# EAGLE design Platine (EAGLE 7.3.0)
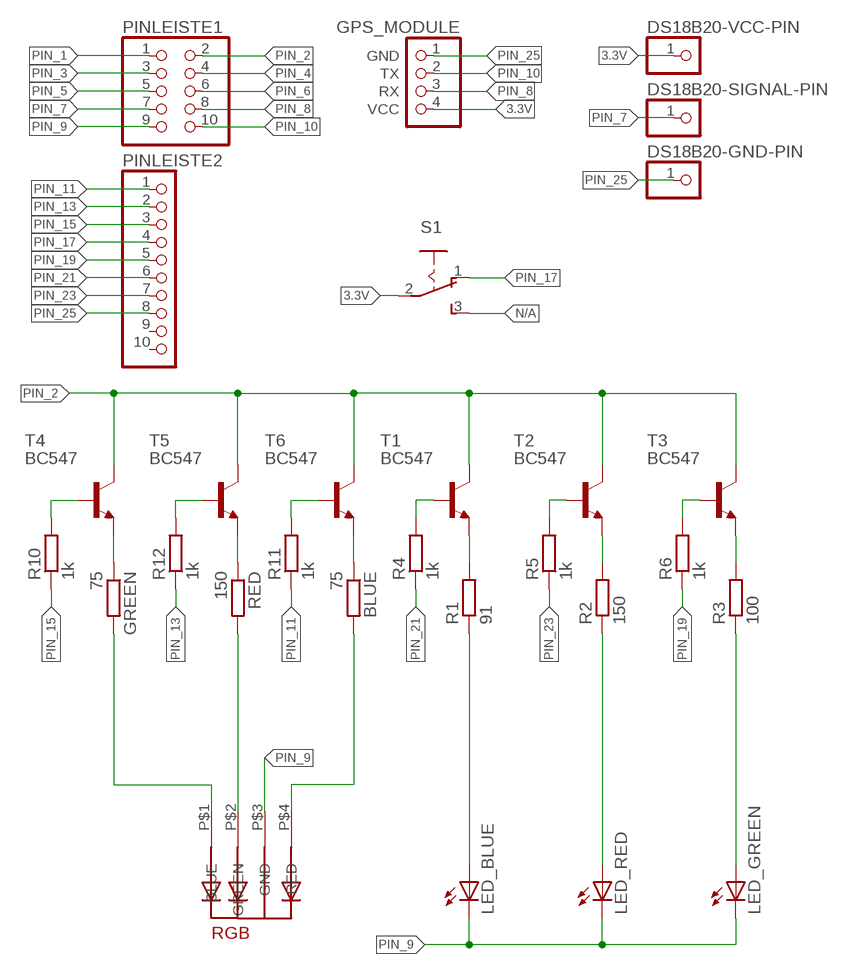
[diagram p0: schematic, sheet 1]

## Parts
BLUE  75  R-EU_0207/10  [0207/10]
DS18B20-GND-PIN  PINHD-1X1  [1X01]
DS18B20-SIGNAL-PIN  PINHD-1X1  [1X01]
DS18B20-VCC-PIN  PINHD-1X1  [1X01]
GPS_MODULE  PINHD-1X4  [1X04]
GREEN  75  R-EU_0207/10  [0207/10]
LED_BLUE  LED5MM  [LED5MM]
LED_GREEN  LED5MM  [LED5MM]
LED_RED  LED5MM  [LED5MM]
PINLEISTE1  PINHD-2X5  [2X05]
PINLEISTE2  PINHD-1X10  [1X10]
R1  91  R-EU_0207/10  [0207/10]
R2  150  R-EU_0207/10  [0207/10]
R3  100  R-EU_0207/10  [0207/10]
R4  1k  R-EU_0207/10  [0207/10]
R5  1k  R-EU_0207/10  [0207/10]
R6  1k  R-EU_0207/10  [0207/10]
R10  1k  R-EU_0207/10  [0207/10]
R11  1k  R-EU_0207/10  [0207/10]
R12  1k  R-EU_0207/10  [0207/10]
RED  150  R-EU_0207/10  [0207/10]
RGB  5MMRGBLED  [LED5MMRGB]
S1  255SB  [255SB]
T1  BC547  [TO92]
T2  BC547  [TO92]
T3  BC547  [TO92]
T4  BC547  [TO92]
T5  BC547  [TO92]
T6  BC547  [TO92]

## Nets
3.3V: DS18B20-VCC-PIN.1 GPS_MODULE.4(VCC) S1.2(P)
N$1: R4.2 T1.2(B)
N$2: R3.2 T3.1(E)
N$3: R2.2 T2.1(E)
N$4: R1.2 T1.1(E)
N$5: LED_BLUE.A R1.1
N$6: LED_RED.A R2.1
N$7: LED_GREEN.A R3.1
N$8: R5.2 T2.2(B)
N$9: R6.2 T3.2(B)
N$10: GREEN.1 T4.1(E)
N$11: RED.1 T5.1(E)
N$12: BLUE.2 RGB.P$4(RED)
N$13: RED.2 RGB.P$2(GREEN)
N$14: GREEN.2 RGB.P$1(BLUE)
N$15: BLUE.1 T6.1(E)
N$16: R10.2 T4.2(B)
N$17: R12.2 T5.2(B)
N$18: R11.2 T6.2(B)
N/A: S1.3(S)
PIN_1: PINLEISTE1.1
PIN_2: PINLEISTE1.2 T1.3(C) T2.3(C) T3.3(C) T4.3(C) T5.3(C) T6.3(C)
PIN_3: PINLEISTE1.3
PIN_4: PINLEISTE1.4
PIN_5: PINLEISTE1.5
PIN_6: PINLEISTE1.6
PIN_7: DS18B20-SIGNAL-PIN.1 PINLEISTE1.7
PIN_8: GPS_MODULE.3(RX) PINLEISTE1.8
PIN_9: LED_BLUE.K(C) LED_GREEN.K(C) LED_RED.K(C) PINLEISTE1.9 RGB.P$3(GND)
PIN_10: GPS_MODULE.2(TX) PINLEISTE1.10
PIN_11: PINLEISTE2.1 R11.1
PIN_13: PINLEISTE2.2 R12.1
PIN_15: PINLEISTE2.3 R10.1
PIN_17: PINLEISTE2.4 S1.1(O)
PIN_19: PINLEISTE2.5 R6.1
PIN_21: PINLEISTE2.6 R4.1
PIN_23: PINLEISTE2.7 R5.1
PIN_25: DS18B20-GND-PIN.1 GPS_MODULE.1(GND) PINLEISTE2.8
Unconnected: PINLEISTE2.9 PINLEISTE2.10

## Library data of the parts
BLUE GREEN R1-R6 R10-R12 RED = rcl:R-EU_: RESISTOR, European symbol
DS18B20-GND-PIN DS18B20-SIGNAL-PIN DS18B20-VCC-PIN = pinhead:PINHD-1X1: PIN HEADER
GPS_MODULE = pinhead:PINHD-1X4: PIN HEADER
LED_BLUE LED_GREEN LED_RED = led:LED: LED OSRAM: - CHIPLED LG R971, LG N971, LY N971, LG Q971, LY Q971, LO R971, LY R971 LH N974, LH R974 LS Q976, LO Q976, LY Q976 LO Q996 - Hyper CHIPLED LW Q18S LB Q993, LB Q99A, LB R99A - SideLED LS A670, LO A670, LY A670, LG A670, LP A670 LB A673, LV A673, LT A673, LW A673 LH A674 LY A675 LS A676, LA A676, LO A676, LY A676, LW A676 LS A679, LY A679, LG A679 - Hyper Micro SIDELED® LS Y876, LA Y876, LO Y876, LY Y876 LT Y87S - SmartLED LW L88C, LW L88S LB L89C, LB L89S, LG L890 LS L89K, LO L89K, LY L89K LS L896, LA L896, LO L896, LY L896 - TOPLED LS T670, LO T670, LY T670, LG T670, LP T670 LSG T670, LSP T670, LSY T670, LOP T670, LYG T670 LG T671, LOG T671, LSG T671 LB T673, LV T673, LT T673, LW T673 LH T674 LS T676, LA T676, LO T676, LY T676, LB T676, LH T676, LSB T676, LW T676 LB T67C, LV T67C, LT T67C, LS T67K, LO T67K, LY T67K, LW E67C LS E67B, LA E67B, LO E67B, LY E67B, LB E67C, LV E67C, LT E67C LW T67C LS T679, LY T679, LG T679 LS T770, LO T770, LY T770, LG T770, LP T770 LB T773, LV T773, LT T773, LW T773 LH T774 LS E675, LA E675, LY E675, LS T675 LS T776, LA T776, LO T776, LY T776, LB T776 LHGB T686 LT T68C, LB T68C - Hyper Mini TOPLED® LB M676 - Mini TOPLED Santana® LG M470 LS M47K, LO M47K, LY M47K Source: http://www.osram.convergy.de LUXEON: - LUMILED® LXK2-PW12-R00, LXK2-PW12-S00, LXK2-PW14-U00, LXK2-PW14-V00 LXK2-PM12-R00, LXK2-PM12-S00, LXK2-PM14-U00 LXK2-PE12-Q00, LXK2-PE12-R00, LXK2-PE12-S00, LXK2-PE14-T00, LXK2-PE14-U00 LXK2-PB12-K00, LXK2-PB12-L00, LXK2-PB12-M00, LXK2-PB14-N00, LXK2-PB14-P00, LXK2-PB14-Q00 LXK2-PR12-L00, LXK2-PR12-M00, LXK2-PR14-Q00, LXK2-PR14-R00 LXK2-PD12-Q00, LXK2-PD12-R00, LXK2-PD12-S00 LXK2-PH12-R00, LXK2-PH12-S00 LXK2-PL12-P00, LXK2-PL12-Q00, LXK2-PL12-R00 Source: www.luxeon.com KINGBRIGHT: KA-3528ASYC Source: www.kingbright.com
PINLEISTE1 = pinhead:PINHD-2X5: PIN HEADER
PINLEISTE2 = pinhead:PINHD-1X10: PIN HEADER
RGB = led_rgb:5MMRGBLED
S1 = switch:255SB: SLIDING SWITCH Distributor Buerklin, 11G810
T1-T6 = transistor:BC547: NPN TRANSISTOR

## Board
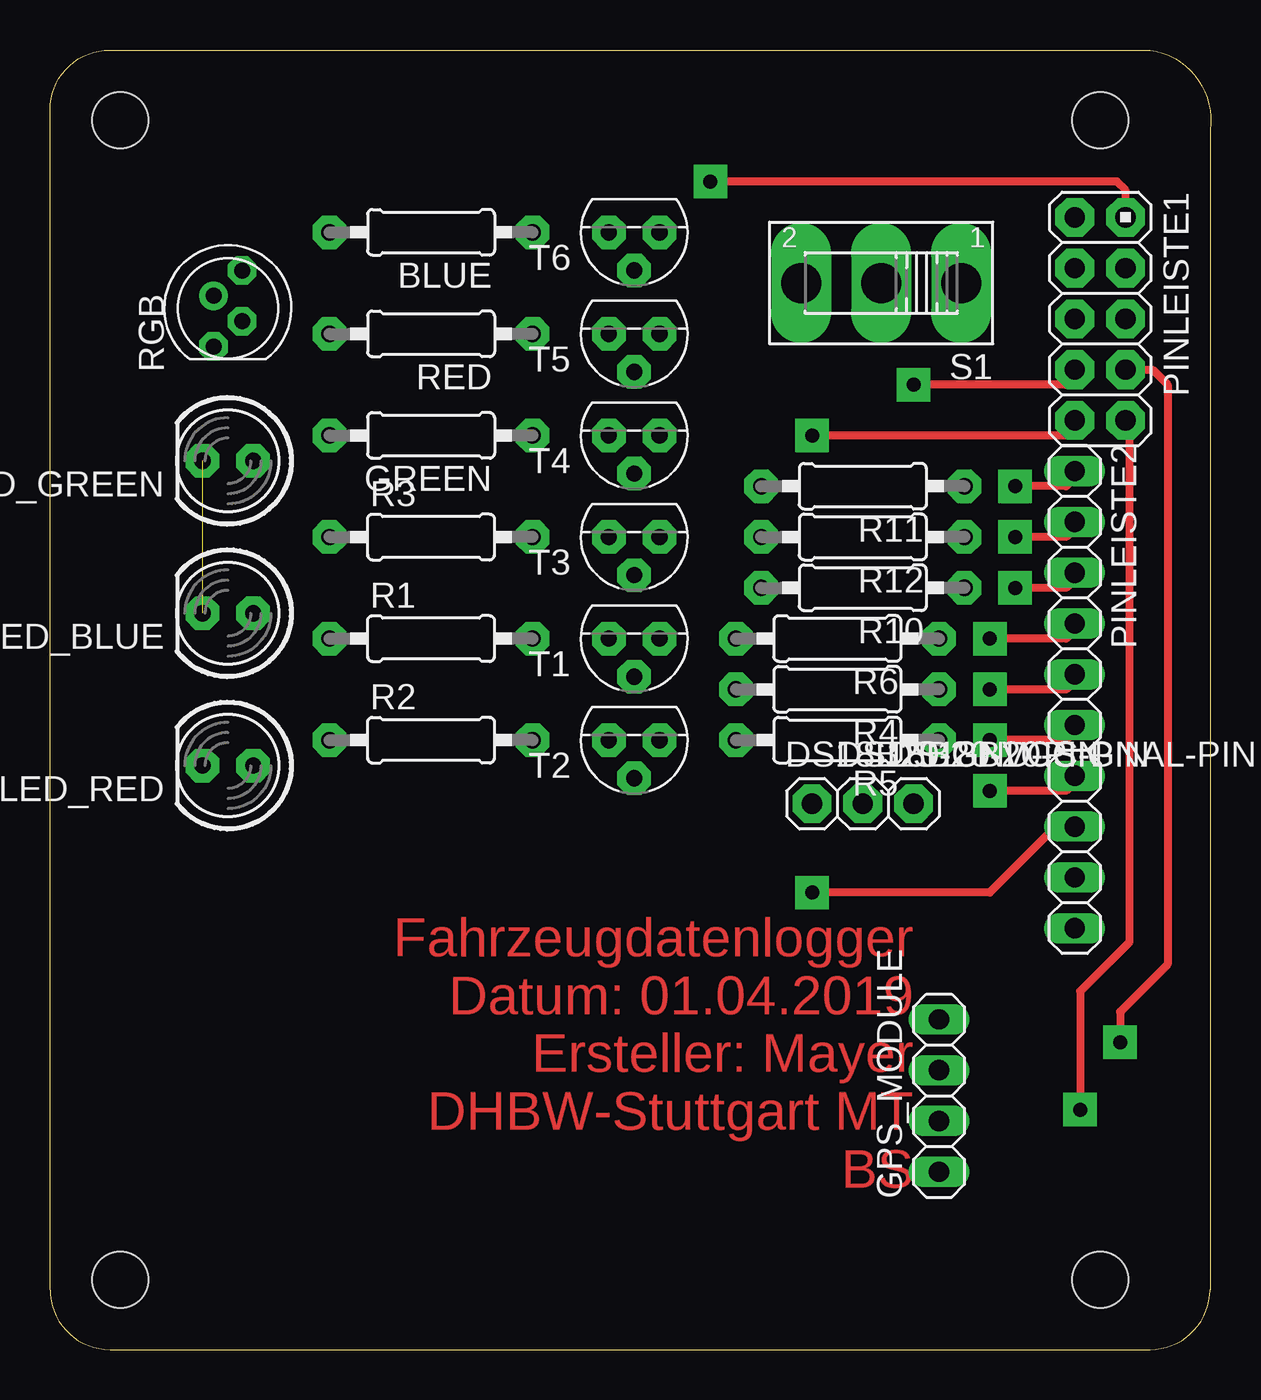
[diagram p1: board, top side]
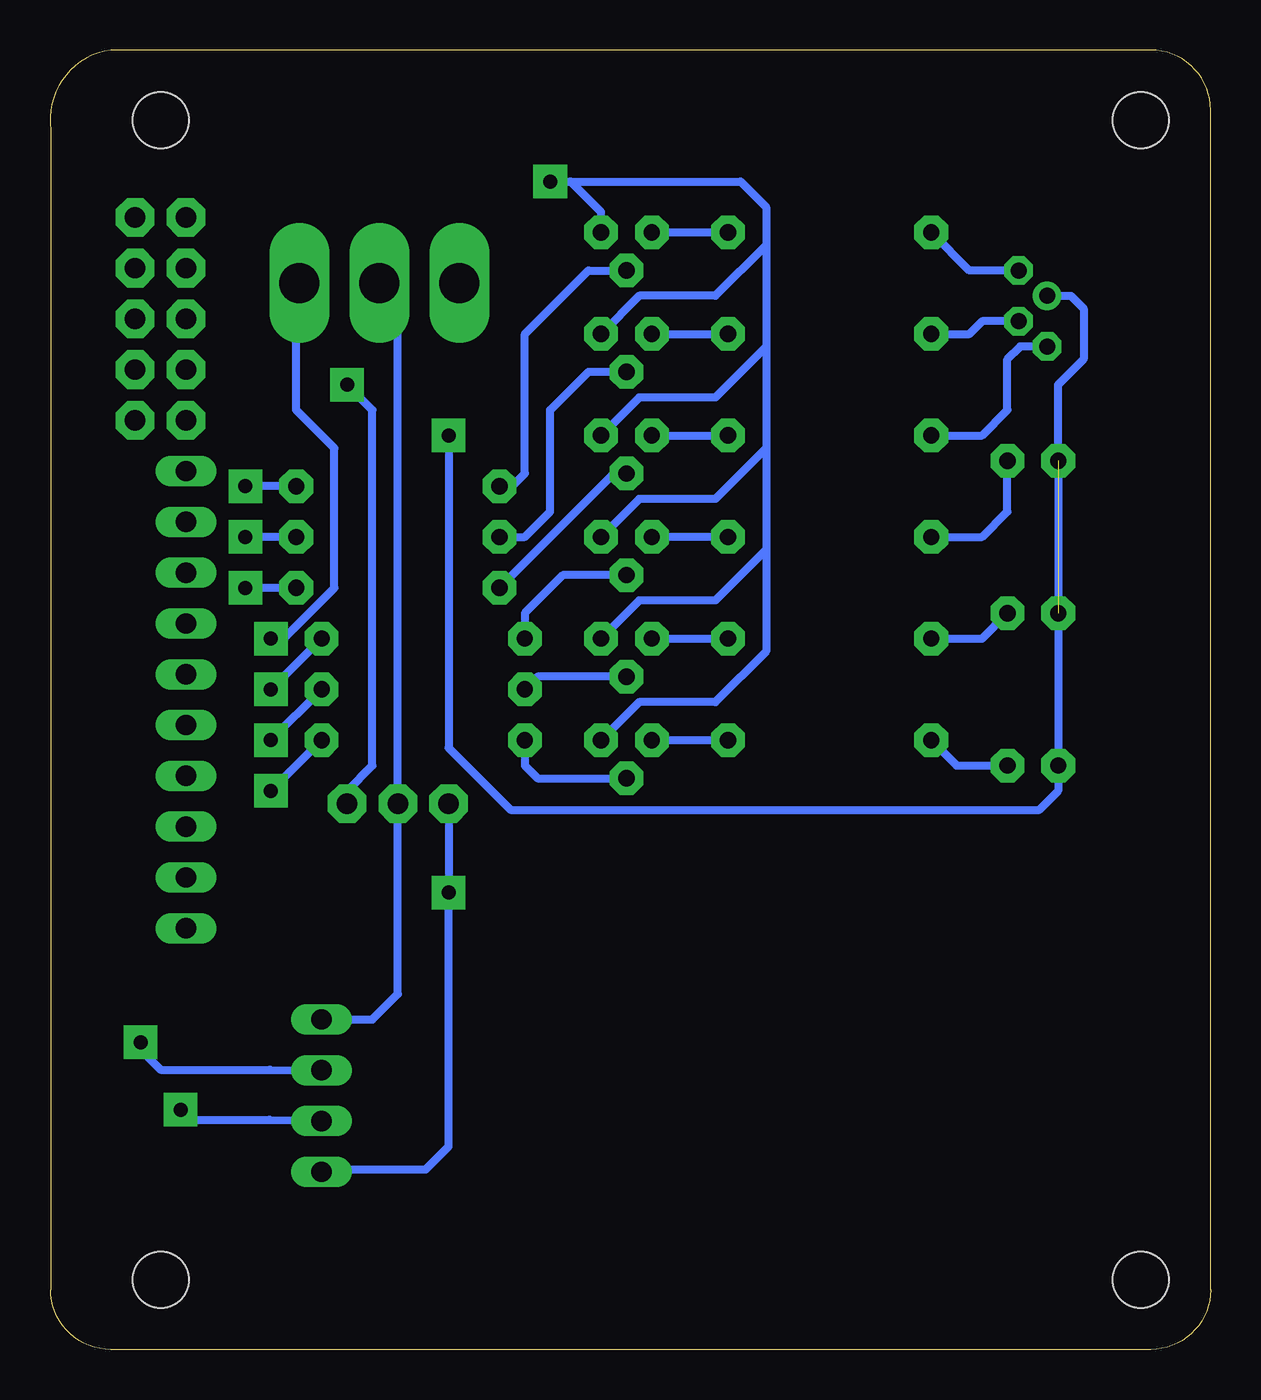
[diagram p2: board, bottom side, seen from below]

Size 58.03 x 65 mm. Coordinates in mm from the lower left corner, seen from the top.
Outline: 0,3 0,62 arc-90 3,65 55,65 arc-90 58,61 58,3 arc-90 55,0 3,0 arc-90 0,3
Copper layers (1*16): Top 0.035mm / dielectric 1.5mm / Bottom 0.035mm
Design rules "default *": minimum track width 10mil, minimum drill 24mil, track to track 10mil, track to pad 10mil, pad to pad 10mil, via to via 10mil, smd to smd 10mil, copper to edge 40mil, drill to drill 10mil, minimum pad ring 10mil, minimum via ring 8mil, stop-mask expansion 4mil, vias tented up to drill 0mil, thermal gap 10mil
Holes 2.8 mm at 3.5,61.5 3.5,3.5 52.5,3.5 52.5,61.5

### Footprints (pad centres in the part's own frame; a part is rotated, then mirrored left to right if it is on the bottom)
0207/10 = drill 0.813 pad 1.676 octagon: 1 -5.08,0; 2 5.08,0
1X01 = drill 1.016 pad 1.93 octagon: 1 0,0
1X04 = drill 1.016 long: 1 -3.81,0; 2 -1.27,0; 3 1.27,0; 4 3.81,0
LED5MM = drill 0.813 pad 1.676 octagon: A -1.27,0; K 1.27,0
2X05 = drill 1.016 pad 1.93 octagon: 1 -5.08,-1.27; 2 -5.08,1.27; 3 -2.54,-1.27; 4 -2.54,1.27; 5 0,-1.27; 6 0,1.27; 7 2.54,-1.27; 8 2.54,1.27; 9 5.08,-1.27; 10 5.08,1.27
1X10 = drill 1.016 long: 1 -11.43,0; 2 -8.89,0; 3 -6.35,0; 4 -3.81,0; 5 -1.27,0; 6 1.27,0; 7 3.81,0; 8 6.35,0; 9 8.89,0; 10 11.43,0
LED5MMRGB = drill 0.8 pad 1.422 octagon: P$1 -1.905,0.714; P$2 -0.635,-0.714; P$4 1.905,-0.714 | drill 0.8 pad 1.422: P$3 0.635,0.714
255SB = drill 2 pad 2.54 long: 1 -4,0; 2 0,0; 3 4,0
TO92 = drill 0.813 pad 1.676 octagon: 1 1.27,0; 2 0,1.905; 3 -1.27,0

### Placement (x,y rotation side)
BLUE  19.05,55.88 180 top
DS18B20-GND-PIN  38.1,27.3 0 top
DS18B20-SIGNAL-PIN  43.18,27.3 0 top
DS18B20-VCC-PIN  40.64,27.3 0 top
GPS_MODULE  44.45,12.7 90 top
GREEN  19.05,45.72 180 top
LED_BLUE  8.89,36.83 180 top
LED_GREEN  8.89,44.45 180 top
LED_RED  8.89,29.21 180 top
PINLEISTE1  52.51,51.55 270 top
PINLEISTE2  51.24,32.5 270 top
R1  19.05,35.56 0 top
R2  19.05,30.48 0 top
R3  19.05,40.64 0 top
R4  39.37,33.02 180 top
R5  39.37,30.48 180 top
R6  39.37,35.56 180 top
R10  40.64,38.1 180 top
R11  40.64,43.18 180 top
R12  40.64,40.64 180 top
RED  19.05,50.8 180 top
RGB  8.89,52.07 90 top
S1  41.56,53.34 180 top
T1  29.21,35.56 180 top
T2  29.21,30.48 180 top
T3  29.21,40.64 180 top
T4  29.21,45.72 180 top
T5  29.21,50.8 180 top
T6  29.21,55.88 180 top

### Tracks (layer width: path | path; a pad name or v marks a point on that pad's centre or on a via)
3.3V
  Bottom 0.406: S1.2 40.64,52.42 DS18B20-VCC-PIN.1 40.64,17.78 41.91,16.51 GPS_MODULE.4
N$1
  Bottom 0.406: T1.2 33.66,33.66 R4.2
N$2
  Bottom 0.406: R3.2 T3.1
N$3
  Bottom 0.406: T2.1 R2.2
N$4
  Bottom 0.406: T1.1 R1.2
N$5
  Bottom 0.406: LED_BLUE.A 11.43,35.56 R1.1
N$6
  Bottom 0.406: LED_RED.A 12.7,29.21 R2.1
N$7
  Bottom 0.406: R3.1 11.43,40.64 10.16,41.91 LED_GREEN.A
N$8
  Bottom 0.406: R5.2 34.29,29.21 33.66,28.57 T2.2
N$9
  Bottom 0.406: T3.2 32.38,38.73 34.29,36.83 R6.2
N$10
  Bottom 0.406: T4.1 GREEN.1
N$11
  Bottom 0.406: T5.1 RED.1
N$12
  Bottom 0.406: RGB.P$4 12.06,53.98 BLUE.2
N$13
  Bottom 0.406: RGB.P$2 11.43,51.44 12.06,50.8 RED.2
N$14
  Bottom 0.406: RGB.P$1 9.53,50.16 10.16,49.53 10.16,46.99 11.43,45.72 GREEN.2
N$15
  Bottom 0.406: T6.1 BLUE.1
N$16
  Bottom 0.406: T4.2 29.84,43.81 R10.2
N$17
  Bottom 0.406: T5.2 31.11,48.9 33.02,46.99 33.02,41.91 34.29,40.64 R12.2
N$18
  Bottom 0.406: R11.2 34.92,43.18 34.29,43.81 34.29,50.8 31.11,53.98 T6.2
PIN_2  (via drill 0.7 pad 1.68)
  Top 0.406: v33.02,58.42 53.34,58.42 53.78,57.98 PINLEISTE1.2
  Bottom 0.406: v33.02,58.42 32,58.42 | 32,58.42 23.5,58.42 22.23,57.15 22.23,55.24 | T5.3 28.57,52.7 24.77,52.7 22.23,55.24 | T4.3 28.57,47.62 24.77,47.62 22.23,50.16 | 22.23,55.24 22.23,50.16 | 22.23,50.16 22.23,45.09 | 22.23,45.09 22.23,40.01 | 22.23,40.01 22.23,34.92 24.77,32.38 28.57,32.38 T2.3 | 22.23,40.01 24.77,37.47 28.57,37.47 T1.3 | 22.23,45.09 24.77,42.55 28.57,42.55 T3.3 | T6.3 30.48,56.9 32,58.42
PIN_7  (via drill 0.7 pad 1.68)
  Top 0.406: PINLEISTE1.7 51.24,48.7 50.8,48.26 v43.18,48.26
  Bottom 0.406: v43.18,48.26 41.91,46.99 41.91,29.21 43.18,27.94 DS18B20-SIGNAL-PIN.1
PIN_8  (via drill 0.7 pad 1.68)
  Top 0.406: v53.5,15.37 53.5,16.89 55.88,19.27 55.88,48.26 55.13,49.01 PINLEISTE1.8
  Bottom 0.406: v53.5,15.37 53.5,15 52.5,14 47.02,14 GPS_MODULE.3
PIN_9  (via drill 0.7 pad 1.68)  (1 unrouted)
  Top 0.406: PINLEISTE1.9 51.24,46.16 50.8,45.72 v38.1,45.72
  Bottom 0.406: RGB.P$3 6.99,52.7 6.35,52.07 6.35,49.53 7.62,48.26 LED_GREEN.K LED_RED.K 7.62,27.94 8.56,27 35,27 38.1,30.1 v38.1,45.72
PIN_10  (via drill 0.7 pad 1.68)
  Top 0.406: v51.5,12 51.5,17.92 53.98,20.39 53.98,46.27 PINLEISTE1.10
  Bottom 0.406: v51.5,12 51,11.5 47.06,11.5 GPS_MODULE.2
PIN_11  (via drill 0.7 pad 1.68)
  Top 0.406: v48.26,43.18 50.8,43.18 51.24,43.62 PINLEISTE2.1
  Bottom 0.406: R11.1 v48.26,43.18
PIN_13  (via drill 0.7 pad 1.68)
  Top 0.406: v48.26,40.64 50.8,40.64 51.24,41.08 PINLEISTE2.2
  Bottom 0.406: R12.1 v48.26,40.64
PIN_15  (via drill 0.7 pad 1.68)
  Top 0.406: v48.26,38.1 50.8,38.1 51.24,38.54 PINLEISTE2.3
  Bottom 0.406: R10.1 v48.26,38.1
PIN_17  (via drill 0.7 pad 1.68)
  Top 0.406: v46.99,35.56 50.8,35.56 51.24,36 PINLEISTE2.4
  Bottom 0.406: S1.1 45.72,53.18 45.72,46.99 43.81,45.09 43.81,38.1 46.35,35.56 v46.99,35.56
PIN_19  (via drill 0.7 pad 1.68)
  Top 0.406: v46.99,33.02 50.8,33.02 51.24,33.46 PINLEISTE2.5
  Bottom 0.406: v46.99,33.02 R6.1
PIN_21  (via drill 0.7 pad 1.68)
  Top 0.406: v46.99,30.48 50.8,30.48 51.24,30.92 PINLEISTE2.6
  Bottom 0.406: v46.99,30.48 R4.1
PIN_23  (via drill 0.7 pad 1.68)
  Top 0.406: PINLEISTE2.7 51.24,28.38 50.8,27.94 v46.99,27.94
  Bottom 0.406: v46.99,27.94 R5.1
PIN_25  (via drill 0.7 pad 1.68)
  Top 0.406: PINLEISTE2.8 50.28,26.15 46.99,22.86 v38.1,22.86
  Bottom 0.406: GPS_MODULE.1 44.34,9 39.26,9 38.1,10.16 v38.1,22.86 DS18B20-GND-PIN.1

### Text on the board
Top: Fahrzeugdatenlogger / Datum: 01.04.2019 / Ersteller: Mayer / DHBW-Stuttgart MT / BS